# EasyEDA Pro project ProPrj_嵌赛国赛_2025-08-15.epro, board PCB1
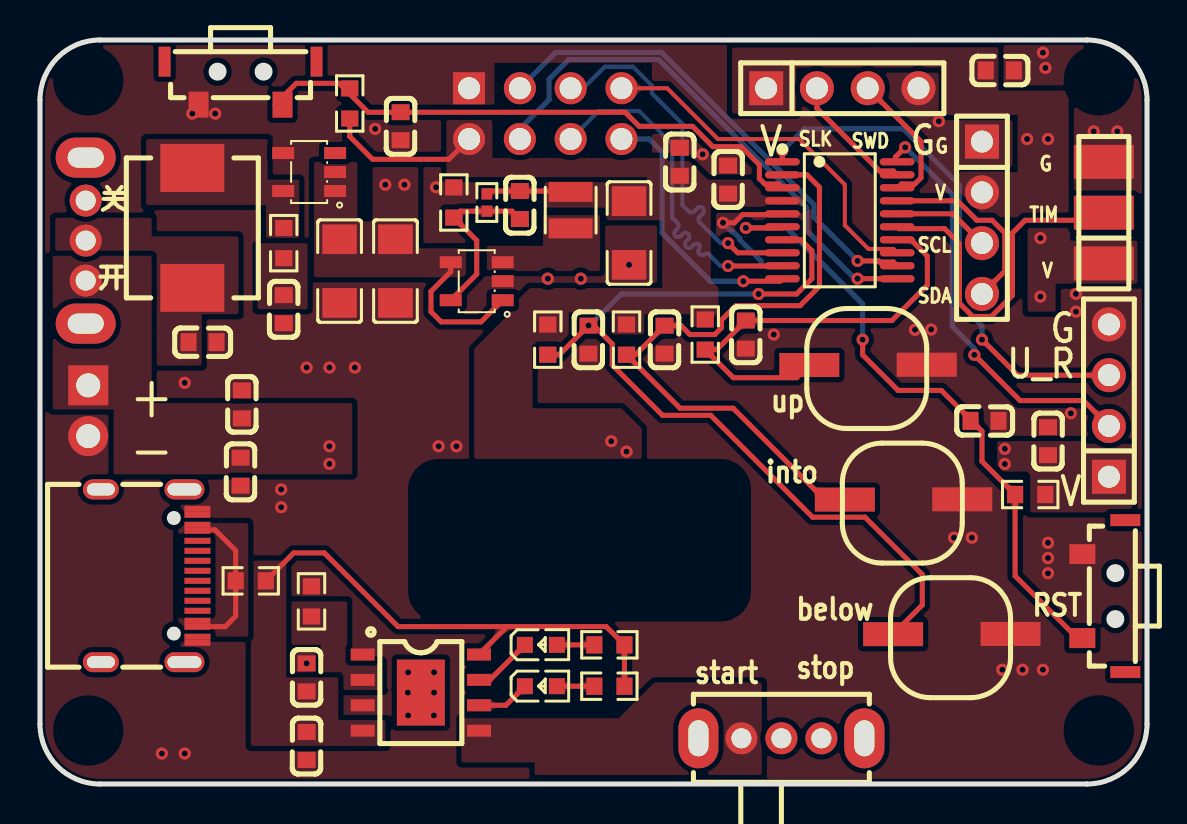
[diagram p20: board, top side]
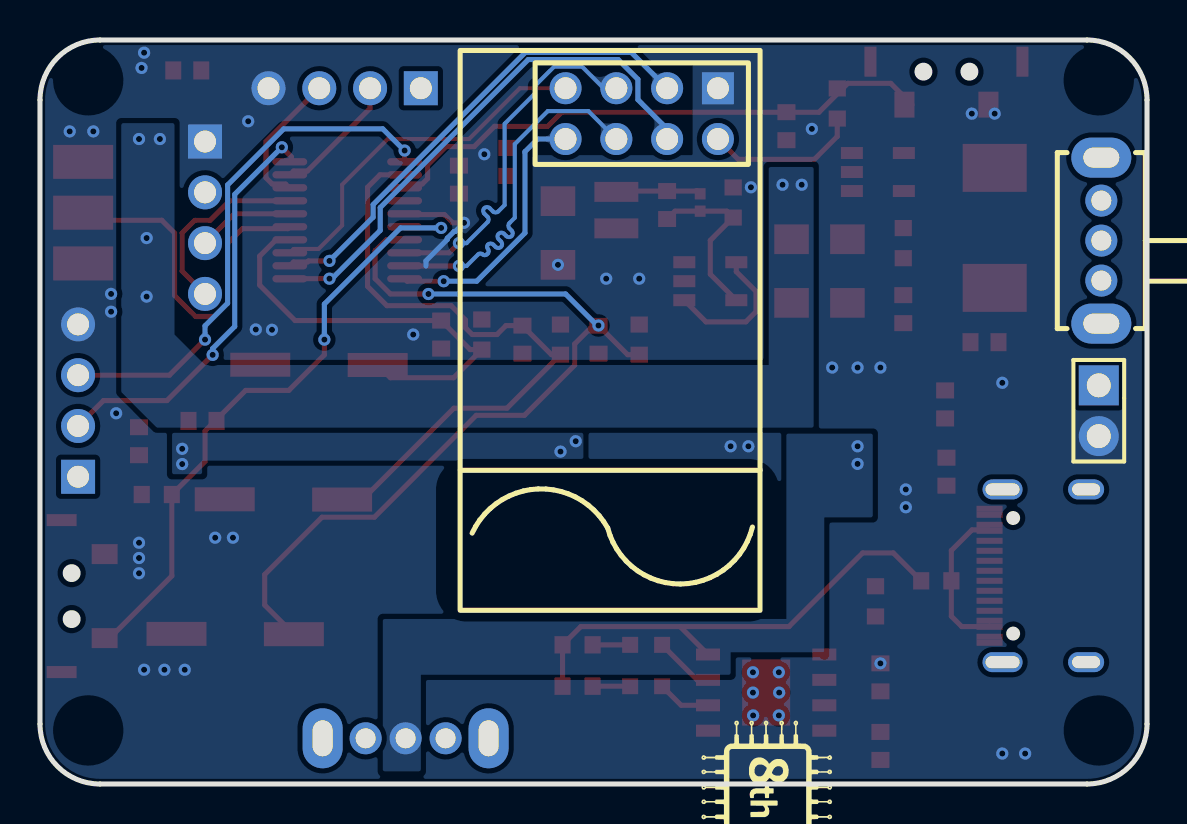
[diagram p21: board, bottom side, seen from below]

Outline 55.37 x 37.21 mm; copper layers: Top Layer, Bottom Layer. Coordinates in mm from the lower left corner of the outline.
Outline path: 0,34.21 0,3 arc(0.88,0.88) 3,0 52.37,0 arc(54.49,0.88) 55.37,3 55.37,34.21 arc(54.49,36.33) 52.37,37.21 3,37.21 arc(0.88,36.33) 0,34.21
Stack: Top Layer 0.035mm / Dielectric1 1.51mm FR4 er 4.5 / Bottom Layer 0.035mm

## Design rules (mm)
template: 自定义配置
spacing copperThickness1oz (default): track to track 0.102, other pairs 0.152 to 0.3
spacing copperThickness2oz: track to track 0.203, other pairs 0.152 to 0.3
track width copperThickness1oz (default): min 0.127, default 0.254, max 2.54
track width copperThickness2oz: min 0.203, default 0.254, max 2.54
differential pair differentialPair (default): width min 0.127, default 0.254, max 2.54; gap min 0.152, default 0.152
via viaSize (default): diameter min 0.5, default 0.61, max 10; hole min 0.3, default 0.305, max 6.3

## Placement (name value [footprint] x y rotation side)
C1  4.7nf  [C0603]  12.19 23.75 90 top
C2  4.7uf  [C0603]  8.13 22.1 180 top
C3  22UF  [C1206]  14.99 25.65 90 top
C4  10uF  [C0603]  10.1 18.98 270 top
C20  100nF  [C0603]  47.24 18.16 180 top
C21  100nF  [C0603]  27.43 22.23 90 top
C22  100nF  [C0603]  35.31 22.48 90 top
C23  100nF  [C0603]  31.24 22.23 90 top
C24  100nF  [C0603]  18.04 32.9 90 top
C25  22uF  [C1206]  17.78 25.65 90 top
C26  22uF  [C1206]  29.46 27.56 270 top
C27  100pF  [C0603]  24 28.96 90 top
C28  100nF  [C0603]  32 31.11 90 top
C29  100nF  [C0603]  34.42 30.23 270 top
C30  100nF  [C0603]  48.01 35.69 180 top
C31  100nF  [C0603]  13.34 1.91 90 top
C32  10uF  [C0603]  13.34 5.33 270 top
C33  100nF  [C0603]  10.03 15.62 90 top
C34  100nF  [C0603]  50.42 17.14 270 top
H1  PZ254V-11-04P  [HDR-TH_4P-P2.54-V-M]  53.47 19.18 90 top
H2  PZ254V-11-04P  [HDR-TH_4P-P2.54-V-M]  47.12 28.32 270 top
H3  PZ254V-11-03P  [HDR-TH_3P-P2.54-V-M]  53.21 28.58 90 top
H4  PZ254V-11-04P  [HDR-TH_4P-P2.54-V-M]  40.13 34.8 0 top
H5  PZ254V-11-02P  [HDR-TH_2P-P2.54-V-M]  2.41 18.67 270 bottom
L3  2.2uH  [IND-SMD_L2.5-W2.0_MHCD252012A]  26.54 28.7 90 top
LED1  LTST-C190KSKT  [LED0603-RD]  25.05 4.89 0 top
LED2  LTST-C190KSKT  [LED0603-RD]  25.05 6.96 0 top
R1  250mΩ  [R0603]  10.54 10.16 0 top
R2  2kΩ  [R0603]  28.48 6.96 0 top
R3  10kΩ  [R0603]  28.48 4.89 0 top
R4  0.5  [R0603]  12.19 27.05 90 top
R14  10kΩ  [R0603]  49.53 14.48 0 top
R15  10kΩ  [R0603]  25.4 22.23 90 top
R16  10kΩ  [R0603]  33.27 22.48 90 top
R17  10kΩ  [R0603]  29.34 22.23 90 top
R18  10kΩ  [R0603]  15.49 34.04 270 top
R31  450kΩ  [R0402]  22.35 29.08 90 top
R32  100kΩ  [R0603]  20.7 29.08 90 top
R33  1.2kΩ  [R0603]  13.58 9.14 270 top
SW1  SK12D07VG5  [SW-TH_SK12D07VG5]  2.29 27.18 90 bottom
SW9  TS-KG012EV  [SW-SMD_TS-KG012EV]  53.21 9.4 90 top
SW13  TS-KG012EV  [SW-SMD_TS-KG012EV]  10.03 35.05 180 top
SW14  SK12D07VG5  [SW-TH_SK12D07VG5]  37.08 2.29 0 top
U1  STM32G030F6P6  [TSSOP-20_L6.5-W4.4-P0.65-LS6.4-BL]  40 28.19 270 top
U2  2.54-2*4  [HDR-TH_8P-P2.54-V-F-R2-C4-S2.54]  25.27 33.53 0 bottom
U3  PW5100  [SOT-23-5_L3.0-W1.7-P0.95-LS2.8-BR]  13.46 30.61 0 top
U4  4.7uH  [IND-SMD_L7.0-W6.6]  7.62 27.81 90 top
U24  ME3103AM5G  [SOT-23-5_L3.0-W1.7-P0.95-LS2.8-BR]  21.84 25.15 0 top
U25  ZX-QC36-4.3TPWD  [BUTTON_BIG]  41.4 20.95 0 top
U26  ZX-QC36-4.3TPWD  [BUTTON_BIG]  43.18 14.22 0 top
U27  ZX-QC36-4.3TPWD  [BUTTON_BIG]  45.59 7.49 0 top
U28  TP4056  [ESOP-8_L4.9-W3.9-P1.27-LS6.0-BL-EP]  19.05 4.57 270 top
USB1  KH-TYPE-C-16P  [usb-c-smd_kh-type-c-16p]  5.46 10.41 270 top

## Footprints (pads in the part's own frame, mm; a bottom-side part is the same pattern mirrored in y, then rotated)
BUTTON_BIG
  rect 3x1.2 smd: 1(-2.921,0) 2(2.952,0.014)
C0603
  rect 0.8x0.9 smd: 1(-0.7,0) 2(0.7,0)
C1206
  rect 1.485x1.728 smd: 1(-1.593,0) 2(1.593,0)
ESOP-8_L4.9-W3.9-P1.27-LS6.0-BL-EP
  rect 0.6x1.2 smd: 1(-1.905,-2.909) 2(-0.635,-2.909) 3(0.635,-2.909) 4(1.905,-2.909) 5(1.905,2.909) 6(0.635,2.909) 7(-0.635,2.909) 8(-1.905,2.909)
  rect 3.3x2.4 smd: 9(0,0)
HDR-TH_2P-P2.54-V-M
  rect 2x2 hole 1.2: 1(-1.27,0)
  round 2 hole 1.2: 2(1.27,0)
HDR-TH_3P-P2.54-V-M
  rect 1.7x3 smd: 1(-2.54,0) 2(0,0) 3(2.54,0)
HDR-TH_4P-P2.54-V-M
  rect 1.7x1.7 hole 1.1: 1(-3.81,0)
  round 1.7 hole 1.1: 2(-1.27,0) 3(1.27,0) 4(3.81,0)
HDR-TH_8P-P2.54-V-F-R2-C4-S2.54
  rect 1.6x1.6 hole 1.1: 1(-3.81,-1.27)
  round 1.6 hole 1.1: 2(-3.81,1.27) 3(-1.27,-1.27) 4(-1.27,1.27) 5(1.27,-1.27) 6(1.27,1.27) 7(3.81,-1.27) 8(3.81,1.27)
IND-SMD_L2.5-W2.0_MHCD252012A
  rect 1x2.2 smd: 1(0.913,0) 2(-0.913,0)
IND-SMD_L7.0-W6.6
  rect 2.4x3.2 smd: 1(-3,0) 2(3,0)
LED0603-RD
  rect 0.8x0.8 smd: 1(-0.799,0) 2(0.799,0)
R0402
  rect 0.566x0.54 smd: 1(-0.433,0) 2(0.433,0)
R0603
  rect 0.806x0.864 smd: 1(-0.753,0) 2(0.753,0)
SOT-23-5_L3.0-W1.7-P0.95-LS2.8-BR
  rect 1.1x0.6 smd: 1(1.3,-0.95) 2(1.3,0) 3(1.3,0.95) 4(-1.3,0.95) 5(-1.3,-0.95)
SW-SMD_TS-KG012EV
  rect 1x1.3 smd: 1(2.1,1.075) 2(-2.1,1.075)
  rect 0.6x1.5 smd: 3(-3.8,-1.075) 4(3.8,-1.075)
SW-TH_SK12D07VG5
  oval 1.6x1.6 hole 1: 1(-2,0) 2(0,0) 3(2,0)
  oval 2x3 hole 1x1.8: 4(4.15,0) 5(-4.15,0)
TSSOP-20_L6.5-W4.4-P0.65-LS6.4-BL
  oval 0.364x1.742 smd: 1(-2.925,-2.871) 2(-2.275,-2.871) 3(-1.625,-2.871) 4(-0.975,-2.871) 5(-0.325,-2.871) 6(0.325,-2.871) 7(0.975,-2.871) 8(1.625,-2.871) 9(2.275,-2.871) 10(2.925,-2.871) 11(2.925,2.871) 12(2.275,2.871) 13(1.625,2.871) 14(0.975,2.871) 15(0.325,2.871) 16(-0.325,2.871) 17(-0.975,2.871) 18(-1.625,2.871) 19(-2.275,2.871) 20(-2.925,2.871)
usb-c-smd_kh-type-c-16p
  oval 1x2 hole 0.6x1.7: 1(-4.32,1.765) 2(4.32,1.765)
  oval 1x1.8 hole 0.6x1.4: 3(-4.32,-2.415) 4(4.32,-2.415)
  rect 0.3x1.3 smd: A1(-3.35,2.415) A4(-2.55,2.415) A5(-1.25,2.415) A6(-0.25,2.415) A7(0.25,2.415) A8(1.25,2.415) A9(2.55,2.415) A12(3.35,2.415) B1(3.05,2.415) B4(2.25,2.415) B5(1.75,2.415) B6(0.75,2.415) B7(-0.75,2.415) B8(-1.75,2.415) B9(-2.25,2.415) B12(-3.05,2.415)

## Nets
As in the schematic, except:
$2N696: L3.2 U24.3
$2N697: C27.1 R31.1 R32.1 U24.5

Pads without a net: SW1 3 4 5; SW9 3 4; SW13 3 4; SW14 3 4 5; U3 3; U28 9; USB1 1 2 3 4 A5 A6 A7 A8 B5 B6 B7 B8

## Via types
v1: diameter 0.61, hole 0.305, Top Layer to Bottom Layer, 70 vias

## Routing (per net, layer and track width the routed paths; a pad name or vN(x,y) marks a point on that pad's centre or on a via; arc(x,y) is an arc through that point)
3V3: length 12
  Top Layer w0.254: L3.1 26.5,29.66 C27.2 22.49,29.66 R31.2 ; 21.46,32.26 20.45,31.24 16.64,31.24 15.49,32.39 R18.2
  vias: v1(28.57,17.14) v1(29.34,16.62) v1(48.26,16.76) v1(48.26,16)
5V: length 7.1
  Top Layer w0.254: U24.1 22.06,23.11 20.07,23.11 19.56,23.62 19.56,24.64 20.54,25.62 U24.4
  vias: v1(17.27,29.97) v1(18.23,29.97) v1(49.37,32.26) v1(50.04,27.31) v1(50.04,24.38) v1(50.42,32.26)
GND: length 6.1
  Top Layer w0.254: v1(34.16,28.07) 34.73,28.07 35.14,28.48 37.09,28.48 U1.5
  Bottom Layer w0.254: 36.07,25.91 36.07,26.16 35,27.23 35,27.29 34.66,27.64 34.59,27.64 v1(34.16,28.07)
  vias: v1(6.1,1.52) v1(7.24,20.07) v1(7.24,1.52) v1(7.62,33.53) v1(8.76,33.53) v1(12.06,14.73) v1(12.06,13.84) v1(13.34,20.83) v1(13.34,6.03) v1(14.48,20.83) v1(15.75,20.83) v1(16.76,32.77) v1(19.81,29.84) v1(19.94,16.89) v1(20.83,16.89) v1(25.4,25.27) v1(27.05,25.27) v1(29.46,25.97) v1(33.15,31.5) v1(36.7,22.48) v1(43.77,22.72) v1(44.58,22.73) v1(44.96,33.15) v1(45.72,12.32) v1(46.61,12.32) v1(48.13,5.72) v1(49.15,5.72) v1(50.16,36.58) v1(50.16,5.72) v1(50.29,35.81) v1(50.42,12.06) v1(50.42,11.3) v1(50.42,10.54) v1(51.56,18.54) v1(51.82,24.51) v1(51.82,23.62) v1(52.7,32.64) v1(53.89,32.64)
(no net):
  vias: v1(18.41,5.59) v1(18.4,4.57) v1(18.41,3.43) v1(19.71,5.59) v1(19.71,4.57) v1(19.7,3.43)
BUTTON0: length 28.4
  Top Layer w0.254: U1.3 36.94,30.01 36.25,30.01 35.98,30.28 35.98,30.97 35.08,31.88 33.66,31.88 32.64,32.89 29.97,32.89 29.27,33.6 16.41,33.6 14.96,35.04 12.82,35.04 11.75,33.98
BUTTON_BELOW: length 44
  Top Layer w0.254: U1.7 38.06,27.22 38.61,26.67 38.61,25.27 37.84,24.51 v1(35.94,24.51) ; U27.1 44.13,8.95 44.13,10.48 41.26,13.34 38.64,13.34 33.55,18.44 31.14,18.44 28.63,20.95 28.63,22.01 27.7,22.93 v1(27.44,22.93) 25.98,21.47 R15.1
  Bottom Layer w0.254: 27.43,22.86 29.08,24.51 v1(35.94,24.51)
BUTTON_MIDDLE: length 32.7
  Top Layer w0.254: U1.2 38.36,30.47 38.99,29.84 38.99,24.89 38.02,23.92 34.81,23.92 34.09,23.21 34.09,22.82 33.75,22.48 32.51,22.48 32.07,22.92 C23.2 29.79,21.47 R17.1 32.01,18.8 34.67,18.8 39.24,14.22 U26.1
BUTTON_UP: length 21.8
  Top Layer w0.254: U1.14 43.57,27.22 44.38,26.4 44.38,24.95 42.61,23.18 C22.2 33.85,21.73 R16.1 34.68,20.32 37.85,20.32 U25.1
CE: length 24.4
  Top Layer w0.254: v1(40.89,26.16) 41.94,26.16 42,26.11 42.69,26.11 U1.12
  Bottom Layer w0.254: v1(40.89,26.16) 38.71,28.35 38.71,28.98 31.1,36.59 25.79,36.59 U2.3
CSN: length 26.6
  Top Layer w0.254: v1(40.89,25.27) 42.87,25.27 U1.11
  Bottom Layer w0.254: v1(40.89,25.27) 40.77,25.27 38.35,27.69 38.35,28.83 30.95,36.23 26.45,36.23 25.46,35.25 25.46,34.23 24,32.77 24,32.26
IRQ: length 13.4
  Top Layer w0.254: U1.10 37.01,25.15 v1(35.18,25.15)
  Bottom Layer w0.254: v1(35.18,25.15) 33.53,25.15 31.11,27.56 31.11,31.62 30.48,32.26 29.08,32.26
MISO: length 18.4
  Top Layer w0.203: U2.7 31.37,34.8 33.91,32.26 37.97,32.26 40.26,29.97 40.26,27.94 41.44,26.76 42.69,26.76 U1.13
MOSI: length 18.4
  Top Layer w0.254: U1.9 37.12,25.91 v1(34.42,25.91)
  Bottom Layer w0.203: 26.54,32.26 27.94,33.66 29.97,33.66 31.62,32 31.62,28.32 31.89,28.05 arc(31.95,27.92) 31.89,27.78 31.78,27.67 arc(31.78,27.4) 32.05,27.4 32.16,27.52 arc(32.43,27.52) 32.43,27.25 32.32,27.14 arc(32.32,26.86) 32.59,26.87 32.7,26.98 arc(32.83,27.03) 32.97,26.98 arc(33.01,26.87) 32.97,26.76 arc(32.92,26.65) 32.97,26.54 33.02,26.49 arc(33.13,26.45) 33.24,26.49 arc(33.34,26.54) 33.45,26.49 34.04,25.91 v1(34.42,25.91)
PA1: length 18.4
  Top Layer w0.254: v1(34.42,27.05) 34.9,26.57 U1.8
  Bottom Layer w0.203: v1(34.42,27.05) 34.04,27.05 32.99,28.1 arc(32.93,28.23) 32.99,28.37 33.15,28.53 arc(33.15,28.8) 32.88,28.8 32.72,28.64 arc(32.58,28.58) 32.45,28.64 32.13,28.96 32.13,33.02 30.61,34.54 30.61,34.92 29.66,35.88 28.26,35.88 27.18,34.8 U2.5
PA11: length 4.8
  Top Layer w0.254: H2.3 45.65,28.52 U1.16
PA12: length 9.6
  Top Layer w0.254: H2.4 48.26,25.65 48.26,27.56 47.62,28.19 46.86,28.19 45.89,29.17 U1.17
PA13: length 7
  Top Layer w0.254: U1.18 42.9,29.82 43.09,30.01 43.76,30.01 44.07,30.32 44.07,32.13 41.4,34.8
PA14: length 6.4
  Top Layer w0.254: H4.2 38.86,33.79 42,30.66 42.69,30.66 U1.19
PB0: length 17.9
  Top Layer w0.254: U1.15 42.97,27.78 45.25,27.78 45.99,27.04 45.99,24.04 46.65,23.38 47.58,23.38 48.64,24.44 48.64,27.56 49.28,28.19 52.83,28.19 H3.2
PB3: length 21
  Top Layer w0.254: v1(46.74,21.46) 49.02,19.18 52.2,19.18 H1.2 ; v1(43.28,31.84) 42.8,31.37 42.8,31.12 U1.20
  Bottom Layer w0.254: v1(46.74,21.46) 46.74,21.78 45.63,22.88 45.63,29.49 v1(43.28,31.84)
PB7: length 26.2
  Top Layer w0.254: H1.3 48.89,20.45 v1(47.12,22.23) ; v1(37.13,31.68) U1.1
  Bottom Layer w0.254: 37.21,31.75 38.23,32.77 43.18,32.77 45.99,29.96 45.99,24.04 47.12,22.91 v1(47.12,22.23)
RST: length 32
  Top Layer w0.254: v1(41.15,22.23) 41.15,21.46 42.93,19.69 45.09,19.69 47.12,17.65 47.12,16.14 R14.1 48.78,10.41 52.14,7.04 ; U1.6 37.08,27.81 v1(35.31,27.81)
  Bottom Layer w0.254: v1(35.31,27.81) 37.34,27.81 41.15,24 v1(41.15,22.23)
USB_5V: length 7.8
  Top Layer w0.254: 7.88,12.71 8.75,12.71 9.79,11.68 R1.1 9.79,8.39 9.27,7.87 7.91,7.87 7.88,7.91
$2N697: length 8.7
  Top Layer w0.254: U24.5 21.84,25.5 21.84,27.19 R32.1 21.02,28.65 R31.1 23.61,28.65 C27.1
$2N1277:
  vias: v1(14.48,16.89) v1(14.48,16.01)
$2N2530: length 2.7
  Top Layer w0.254: LED1.1 23.3,3.94 U28.6
$2N2531: length 1.9
  Top Layer w0.254: LED1.2 R3.1
$2N2532: length 1.9
  Top Layer w0.254: LED2.2 R2.1
$2N2533: length 24.5
  Top Layer w0.254: R3.2 R2.2 28.32,7.87 23.36,7.87 ; R1.2 12.69,11.56 14.22,11.56 17.91,7.87 23.36,7.87 ; 23.36,7.87 U28.8
$2N2534: length 3
  Top Layer w0.254: LED2.1 22.5,5.21 U28.7

## Copper pours and planes (outline as drawn; the poured copper is in the pictures)
3V3 on Top Layer: 52.19,17.15 52.32,17.02 54.63,17.02 54.63,13.59 49.53,13.59 49.53,15.46 49.37,15.62 47.88,15.62 47.88,17.14 47.9,17.15
3V3 on Top Layer: 24.5,24.81 31.12,24.81 31.12,28.18 31.11,28.19 28.34,28.19 28.34,28.83 25.23,28.83 25.23,30.1 30.35,30.1 30.35,30.35 20.32,30.35 20.32,33.27 22.63,33.27 22.63,31.31 32.32,31.31 33.4,30.23 35.56,30.23 36.07,29.72 36.07,29.46 38.19,29.46 38.19,28.82 33.67,28.82 33.56,28.93 33.56,25.2 33.93,24.82 33.93,22.97 34.09,22.82 32.52,22.82 32.52,23.5 30.23,23.5 30.23,22.48 28.57,22.48 28.57,23.59 26.45,23.59 26.45,21.97 24.64,21.97 24.64,18.8 29.08,18.8 30.1,17.78 30.1,16.26 21.72,16.26 21.72,21.76 23.5,23.54 23.5,23.81
3V3 on Bottom Layer: 28.19,16.17 28.19,17.78 48.77,17.78 48.77,15.49 47.26,15.49 47.26,16.14 47.23,16.17
3V3ZHUAN5 on Top Layer: 0.76,28.32 5.59,28.32 5.59,27.39 9.93,27.39 9.93,23.5 8.09,23.5 8.09,20.93 5.73,20.93 5.73,26.52 0.76,26.52
5V on Top Layer: 13.71,25.35 13.71,31.11 15.88,31.11 15.88,28.27 16,28.14 16.64,28.14 16.64,30.86 18.92,30.86 18.92,26.8 21.31,26.8 21.31,25.35
5V on Top Layer: 49.4,27.94 49.4,23.62 50.8,23.62 50.8,25.03 54.89,25.03 54.89,27.18 51.53,27.18 51.53,27.94
5V on Top Layer: 51.46,28.32 51.46,34.68 47.94,34.68 47.94,36.85 34.62,36.83 34.62,33.53 37.82,33.53 37.82,35.84 45.21,35.84 45.21,33.45 48.89,33.45 48.89,30.59 48.39,30.63 46,30.63 45.97,30.61 45.97,28.36 45.99,28.35 48.85,28.35 48.88,28.32
5V on Bottom Layer: 51.31,19.6 49.53,17.82 16.67,17.82 16.67,30.89 16.7,30.86 18.92,30.86 18.92,20.95 47.12,20.95 48.64,22.48 48.64,33.05 51.31,33.05
GND on Top Layer: -8.13,41.02 77.72,41.02 78.74,40 78.74,15.62 59.31,-3.81 -5.84,-3.81 -8.13,-1.52
GND on Bottom Layer: -2.67,40.51 67.44,40.51 70.48,37.47 70.48,-2.16 61.72,-10.92 -2.29,-10.92 -3.94,-12.57 -3.94,39.24
BAT+ on Top Layer: 24.76,1.08 21.08,1.08 21.08,3.27 21.1,3.29 28.94,3.29 30.73,5.08 36.11,5.08 36.11,0.45 24.74,0.45 24.74,1.05
USB_5V on Top Layer: 6.93,13.05 10.41,13.05 10.41,7.37 6.92,7.37 6.92,13.04
$2N686 on Top Layer: 5.31,28.96 5.31,32.23 5.33,32.26 11.39,32.26 11.39,30.23 12.97,30.23 12.97,27.32 12.95,27.31 11.3,27.31 11.3,28.96
$2N687 on Top Layer: 11.01,27.05 13.39,27.05 13.39,23.83 13.38,23.75 10.88,23.75 10.88,26.92
$2N696 on Top Layer: 22.35,25.65 28.01,25.65 28.01,28.45 25.16,28.45 25.16,26.92 22.35,26.92
$2N1277 on Top Layer: 0.63,18.73 3.68,18.73 3.68,15.48 15.61,15.48 15.62,15.49 15.62,19.05 5.59,19.05 5.59,26.42 0.63,26.42
$2N1277 on Bottom Layer: 36.32,0.64 36.32,5.46 20.83,5.46 20.83,6.59 16.25,6.59 16.14,6.48 16.14,13.34 13.72,13.34 13.72,17.53 18.04,17.53 18.04,8.25 38.23,8.25 38.23,0.64
$2N2533 on Top Layer: 10.54,11.18 12.32,11.18 12.32,5.33 14.92,5.33 14.92,3.2 17.28,3.2 17.28,1.91 10.54,1.91
$2N2537 on Top Layer: 12.57,9.14 15.37,9.14 15.37,6.14 17.1,6.14 17.1,4.75 17.14,4.7 15.06,4.7 15.06,5.59 14.04,5.59 14.04,6.96 12.57,6.96

Small or netless copper shapes (teardrops, artwork), in the pictures only: 63 on Top Layer, 13 on Bottom Layer

## Text on the board
Top Silkscreen Layer: SLK | SWD | SCL | SDA | V | G | TIM | start | into | up | below | stop | RST | U_R | + | - | v | 开 | 关
